# EasyEDA schematic SCH_CubeNixie_2024-07-25.json
TITLE: Cube Nixie; REV: 1.2; Date: 2023-08-09; Sheet: 1/1; Drawn By: cubus; Company: Cubus
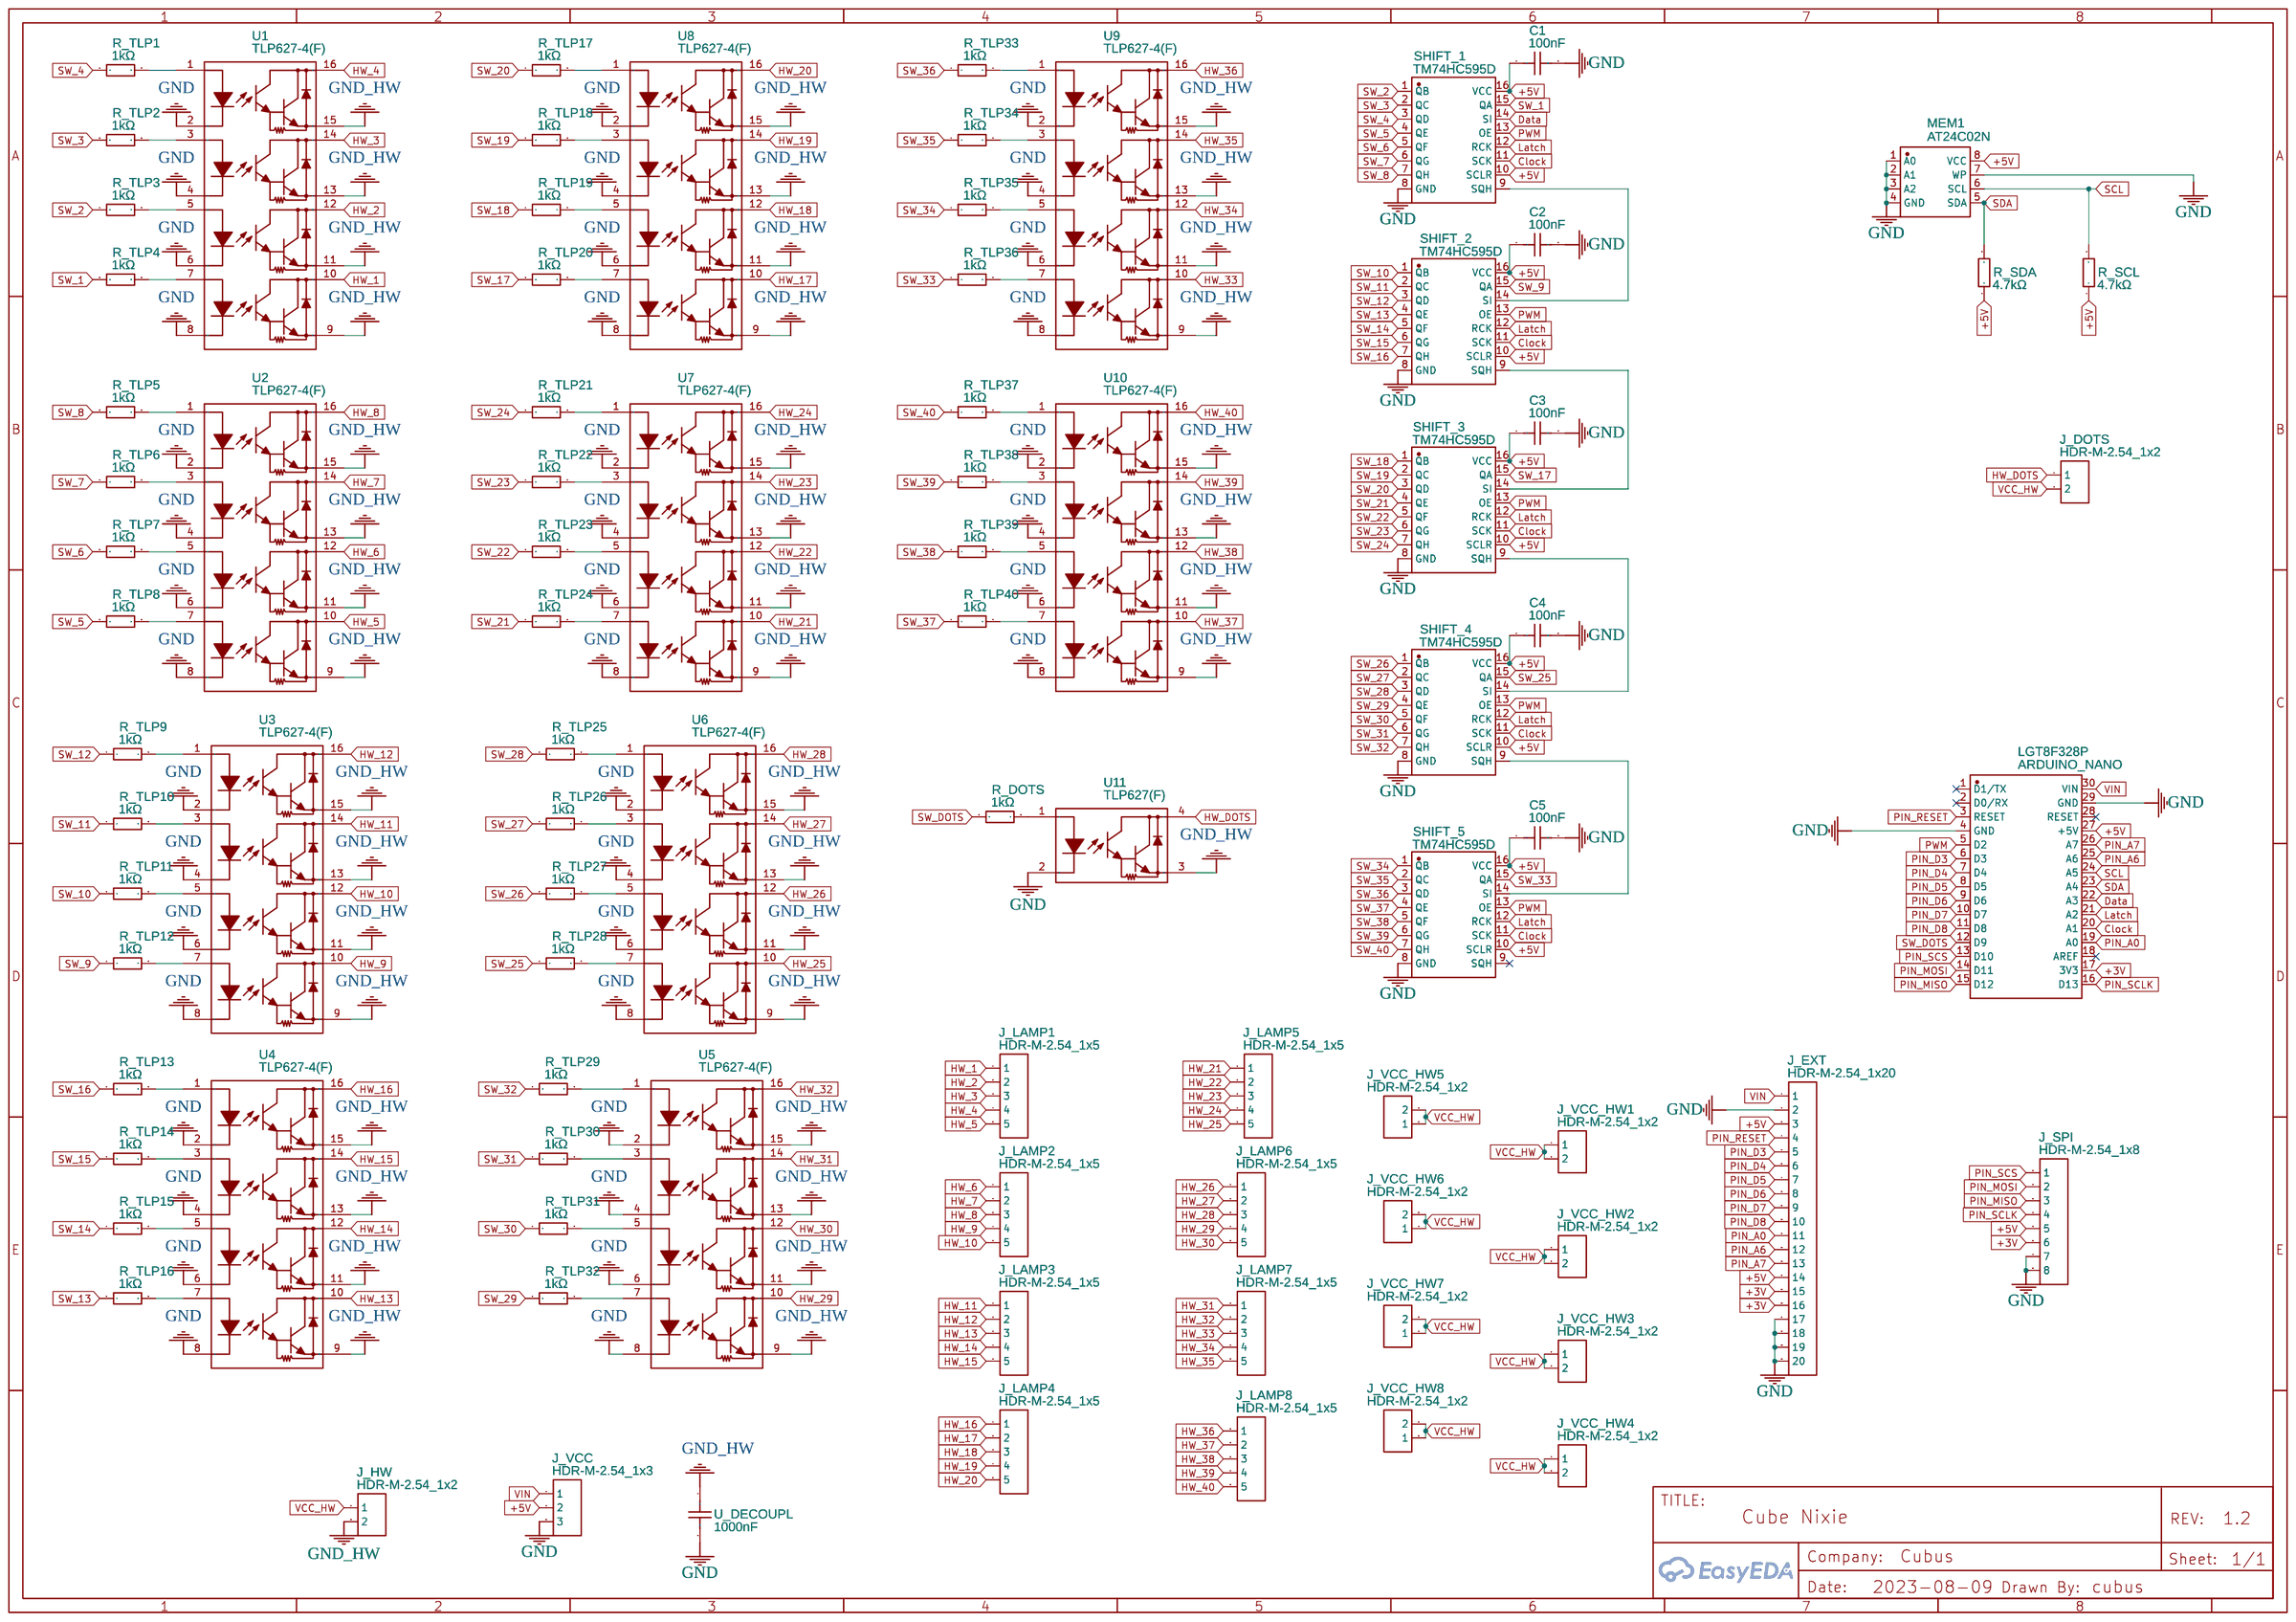
[diagram p0: schematic sheet]

## Parts
C1  100nF  [C1206]
C2  100nF  [C1206]
C3  100nF  [C1206]
C4  100nF  [C1206]
C5  100nF  [C1206]
J_DOTS  HDR-M-2.54_1x2  [HDR-M-2.54_1X2]
J_EXT  HDR-M-2.54_1x20  [HDR-M-2.54_1X20]
J_HW  HDR-M-2.54_1x2  [HDR-M-2.54_1X2]
J_LAMP1  HDR-M-2.54_1x5  [HDR-M-2.54_1X5]
J_LAMP2  HDR-M-2.54_1x5  [HDR-M-2.54_1X5]
J_LAMP3  HDR-M-2.54_1x5  [HDR-M-2.54_1X5]
J_LAMP4  HDR-M-2.54_1x5  [HDR-M-2.54_1X5]
J_LAMP5  HDR-M-2.54_1x5  [HDR-M-2.54_1X5]
J_LAMP6  HDR-M-2.54_1x5  [HDR-M-2.54_1X5]
J_LAMP7  HDR-M-2.54_1x5  [HDR-M-2.54_1X5]
J_LAMP8  HDR-M-2.54_1x5  [HDR-M-2.54_1X5]
J_SPI  HDR-M-2.54_1x8  [HDR-M-2.54_1X8]
J_VCC  HDR-M-2.54_1x3  [HDR-M-2.54_1X3]
J_VCC_HW1  HDR-M-2.54_1x2  [HDR-M-2.54_1X2]
J_VCC_HW2  HDR-M-2.54_1x2  [HDR-M-2.54_1X2]
J_VCC_HW3  HDR-M-2.54_1x2  [HDR-M-2.54_1X2]
J_VCC_HW4  HDR-M-2.54_1x2  [HDR-M-2.54_1X2]
J_VCC_HW5  HDR-M-2.54_1x2  [HDR-M-2.54_1X2]
J_VCC_HW6  HDR-M-2.54_1x2  [HDR-M-2.54_1X2]
J_VCC_HW7  HDR-M-2.54_1x2  [HDR-M-2.54_1X2]
J_VCC_HW8  HDR-M-2.54_1x2  [HDR-M-2.54_1X2]
LGT8F328P  ARDUINO_NANO  [COMM-TH_ARDUINO_NANO]
MEM1  AT24C02N  [DIP-8_L9.2-W6.3-P2.54-LS7.62-BL]
R_DOTS  1kΩ  [R0805]
R_SCL  4.7kΩ  [R0402]
R_SDA  4.7kΩ  [R0402]
R_TLP1  1kΩ  [R0805]
R_TLP2  1kΩ  [R0805]
R_TLP3  1kΩ  [R0805]
R_TLP4  1kΩ  [R0805]
R_TLP5  1kΩ  [R0805]
R_TLP6  1kΩ  [R0805]
R_TLP7  1kΩ  [R0805]
R_TLP8  1kΩ  [R0805]
R_TLP9  1kΩ  [R0805]
R_TLP10  1kΩ  [R0805]
R_TLP11  1kΩ  [R0805]
R_TLP12  1kΩ  [R0805]
R_TLP13  1kΩ  [R0805]
R_TLP14  1kΩ  [R0805]
R_TLP15  1kΩ  [R0805]
R_TLP16  1kΩ  [R0805]
R_TLP17  1kΩ  [R0805]
R_TLP18  1kΩ  [R0805]
R_TLP19  1kΩ  [R0805]
R_TLP20  1kΩ  [R0805]
R_TLP21  1kΩ  [R0805]
R_TLP22  1kΩ  [R0805]
R_TLP23  1kΩ  [R0805]
R_TLP24  1kΩ  [R0805]
R_TLP25  1kΩ  [R0805]
R_TLP26  1kΩ  [R0805]
R_TLP27  1kΩ  [R0805]
R_TLP28  1kΩ  [R0805]
R_TLP29  1kΩ  [R0805]
R_TLP30  1kΩ  [R0805]
R_TLP31  1kΩ  [R0805]
R_TLP32  1kΩ  [R0805]
R_TLP33  1kΩ  [R0805]
R_TLP34  1kΩ  [R0805]
R_TLP35  1kΩ  [R0805]
R_TLP36  1kΩ  [R0805]
R_TLP37  1kΩ  [R0805]
R_TLP38  1kΩ  [R0805]
R_TLP39  1kΩ  [R0805]
R_TLP40  1kΩ  [R0805]
SHIFT_1  TM74HC595D  [SOP-16_L10.0-W3.9-P1.27-LS6.0-BL]
SHIFT_2  TM74HC595D  [SOP-16_L10.0-W3.9-P1.27-LS6.0-BL]
SHIFT_3  TM74HC595D  [SOP-16_L10.0-W3.9-P1.27-LS6.0-BL]
SHIFT_4  TM74HC595D  [SOP-16_L10.0-W3.9-P1.27-LS6.0-BL]
SHIFT_5  TM74HC595D  [SOP-16_L10.0-W3.9-P1.27-LS6.0-BL]
U1  TLP627-4(F)  [DIP-16_L20.0-W6.4-P2.54-LS7.6-BL]
U2  TLP627-4(F)  [DIP-16_L20.0-W6.4-P2.54-LS7.6-BL]
U3  TLP627-4(F)  [DIP-16_L20.0-W6.4-P2.54-LS7.6-BL]
U4  TLP627-4(F)  [DIP-16_L20.0-W6.4-P2.54-LS7.6-BL]
U5  TLP627-4(F)  [DIP-16_L20.0-W6.4-P2.54-LS7.6-BL]
U6  TLP627-4(F)  [DIP-16_L20.0-W6.4-P2.54-LS7.6-BL]
U7  TLP627-4(F)  [DIP-16_L20.0-W6.4-P2.54-LS7.6-BL]
U8  TLP627-4(F)  [DIP-16_L20.0-W6.4-P2.54-LS7.6-BL]
U9  TLP627-4(F)  [DIP-16_L20.0-W6.4-P2.54-LS7.6-BL]
U10  TLP627-4(F)  [DIP-16_L20.0-W6.4-P2.54-LS7.6-BL]
U11  TLP627(F)  [DIP-4_L6.4-W4.6-P2.54-LS7.6-BL]
U_DECOUPL  1000nF  [CAP-TH_L10.5-W5.0-P7.50-D1.2]

## Library data of the parts
C1-C5 = C3216X7R2A104M160AA: Contributor: lcsc; Supplier: LCSC; Supplier Part: C3883507; Manufacturer: TDK; link: https://lcsc.com/eda_search?q=C3883507&%26type=1&ref=editor
J_DOTS J_HW J_VCC_HW1-J_VCC_HW8 = HDR-M-2.54_1x2: Supplier Part: C124375; Supplier: LCSC; Contributor: LCEDA_Lib
J_EXT = HDR-M-2.54_1x20: Supplier Part: C50981; Supplier: LCSC; Contributor: LCEDA_Lib
J_LAMP1-J_LAMP8 = HDR-M-2.54_1x5: Supplier Part: C358687; Supplier: LCSC; Contributor: LCEDA_Lib
J_SPI = HDR-M-2.54_1x8: Supplier Part: C190820; Supplier: LCSC; Contributor: LCEDA_Lib
J_VCC = HDR-M-2.54_1x3: Supplier Part: C180248; Supplier: LCSC; Contributor: LCEDA_Lib
LGT8F328P = ARDUINO_NANO: Supplier: LCSC; Supplier Part: C9900017879; Manufacturer: null; JLCPCB Part Class: Extended Part; Contributor: lcsc
MEM1 = AT24C02N: Supplier: LCSC; Supplier Part: C434606; Manufacturer: HGSEMI; Contributor: LCSC; JLCPCB Part Class: Extended Part
R_DOTS R_TLP1-R_TLP40 = ERJ-6ENF1001V: Contributor: LCSC; Supplier: LCSC; Supplier Part: C79496; Manufacturer: PANASONIC(松下); Manufacturer Part: ERJ6ENF1001V; JLCPCB Part Class: Extended Part; link: https://lcsc.com/eda_search?q=C79496&%26type=1&ref=editor
R_SCL R_SDA = RMC04024.7K5%N: Contributor: LCSC; Supplier: LCSC; Supplier Part: C269679; Manufacturer: Tyohm(幸亚电阻); Manufacturer Part: RMC04024K7JN; JLCPCB Part Class: Extended Part; link: https://lcsc.com/eda_search?q=C269679&%26type=1&ref=editor
SHIFT_1-SHIFT_5 = TM74HC595D: Supplier: LCSC; Manufacturer: TM(天微); Manufacturer Part: TM74HC595; Supplier Part: C79097; JLCPCB Part Class: Extended Part; link: https://lcsc.com/eda_search?q=C79097&%26type=1&ref=editor
U1-U10 = TLP627-4(F): Contributor: LCSC; Supplier: LCSC; Supplier Part: C2987290; Manufacturer: TOSHIBA(东芝); JLCPCB Part Class: Extended Part; link: https://lcsc.com/eda_search?q=C2987290&%26type=1&ref=editor
U11 = TLP627(F): Contributor: LCSC; Supplier: LCSC; Supplier Part: C96253; Manufacturer: TOSHIBA(东芝); JLCPCB Part Class: Extended Part; link: https://lcsc.com/eda_search?q=C96253&%26type=1&ref=editor
U_DECOUPL = CL21-0.1uF400V 5%: Contributor: LCSC; Supplier: LCSC; Supplier Part: C281835; Manufacturer: Tongfeng(铜峰电子); JLCPCB Part Class: Extended Part; link: https://lcsc.com/eda_search?q=C281835&%26type=1&ref=editor

## Nets
+3V: J_EXT.15 J_EXT.16 J_SPI.6 LGT8F328P.17(3V3)
+5V: C1.1 C2.1 C3.1 C4.1 C5.1 J_EXT.3 J_EXT.14 J_SPI.5 J_VCC.2 LGT8F328P.27(+5V) MEM1.8(VCC) R_SCL.1 R_SDA.1 SHIFT_1.10(SCLR) SHIFT_1.16(VCC) SHIFT_2.10(SCLR) SHIFT_2.16(VCC) SHIFT_3.10(SCLR) SHIFT_3.16(VCC) SHIFT_4.10(SCLR) SHIFT_4.16(VCC) SHIFT_5.10(SCLR) SHIFT_5.16(VCC)
GND: C1.2 C2.2 C3.2 C4.2 C5.2 J_EXT.2 J_EXT.17 J_EXT.18 J_EXT.19 J_EXT.20 J_SPI.7 J_SPI.8 J_VCC.3 LGT8F328P.4(GND) LGT8F328P.29(GND) MEM1.1(A0) MEM1.2(A1) MEM1.3(A2) MEM1.4(GND) MEM1.7(WP) SHIFT_1.8(GND) SHIFT_2.8(GND) SHIFT_3.8(GND) SHIFT_4.8(GND) SHIFT_5.8(GND) U1.2 U1.4 U1.6 U1.8 U2.2 U2.4 U2.6 U2.8 U3.2 U3.4 U3.6 U3.8 U4.2 U4.4 U4.6 U4.8 U5.2 U5.4 U5.6 U5.8 U6.2 U6.4 U6.6 U6.8 U7.2 U7.4 U7.6 U7.8 U8.2 U8.4 U8.6 U8.8 U9.2 U9.4 U9.6 U9.8 U10.2 U10.4 U10.6 U10.8 U11.2 U_DECOUPL.2
GND_HW: J_HW.2 U1.9 U1.11 U1.13 U1.15 U2.9 U2.11 U2.13 U2.15 U3.9 U3.11 U3.13 U3.15 U4.9 U4.11 U4.13 U4.15 U5.9 U5.11 U5.13 U5.15 U6.9 U6.11 U6.13 U6.15 U7.9 U7.11 U7.13 U7.15 U8.9 U8.11 U8.13 U8.15 U9.9 U9.11 U9.13 U9.15 U10.9 U10.11 U10.13 U10.15 U11.3 U_DECOUPL.1
VCC_HW: J_DOTS.2 J_HW.1 J_VCC_HW1.1 J_VCC_HW1.2 J_VCC_HW2.1 J_VCC_HW2.2 J_VCC_HW3.1 J_VCC_HW3.2 J_VCC_HW4.1 J_VCC_HW4.2 J_VCC_HW5.1 J_VCC_HW5.2 J_VCC_HW6.1 J_VCC_HW6.2 J_VCC_HW7.1 J_VCC_HW7.2 J_VCC_HW8.1 J_VCC_HW8.2
VIN: J_EXT.1 J_VCC.1 LGT8F328P.30(VIN)
Clock: LGT8F328P.20(A1) SHIFT_1.11(SCK) SHIFT_2.11(SCK) SHIFT_3.11(SCK) SHIFT_4.11(SCK) SHIFT_5.11(SCK)
Data: LGT8F328P.22(A3) SHIFT_1.14(SI)
HW_1: J_LAMP1.1 U1.10
HW_2: J_LAMP1.2 U1.12
HW_3: J_LAMP1.3 U1.14
HW_4: J_LAMP1.4 U1.16
HW_5: J_LAMP1.5 U2.10
HW_6: J_LAMP2.1 U2.12
HW_7: J_LAMP2.2 U2.14
HW_8: J_LAMP2.3 U2.16
HW_9: J_LAMP2.4 U3.10
HW_10: J_LAMP2.5 U3.12
HW_11: J_LAMP3.1 U3.14
HW_12: J_LAMP3.2 U3.16
HW_13: J_LAMP3.3 U4.10
HW_14: J_LAMP3.4 U4.12
HW_15: J_LAMP3.5 U4.14
HW_16: J_LAMP4.1 U4.16
HW_17: J_LAMP4.2 U8.10
HW_18: J_LAMP4.3 U8.12
HW_19: J_LAMP4.4 U8.14
HW_20: J_LAMP4.5 U8.16
HW_21: J_LAMP5.1 U7.10
HW_22: J_LAMP5.2 U7.12
HW_23: J_LAMP5.3 U7.14
HW_24: J_LAMP5.4 U7.16
HW_25: J_LAMP5.5 U6.10
HW_26: J_LAMP6.1 U6.12
HW_27: J_LAMP6.2 U6.14
HW_28: J_LAMP6.3 U6.16
HW_29: J_LAMP6.4 U5.10
HW_30: J_LAMP6.5 U5.12
HW_31: J_LAMP7.1 U5.14
HW_32: J_LAMP7.2 U5.16
HW_33: J_LAMP7.3 U9.10
HW_34: J_LAMP7.4 U9.12
HW_35: J_LAMP7.5 U9.14
HW_36: J_LAMP8.1 U9.16
HW_37: J_LAMP8.2 U10.10
HW_38: J_LAMP8.3 U10.12
HW_39: J_LAMP8.4 U10.14
HW_40: J_LAMP8.5 U10.16
HW_DOTS: J_DOTS.1 U11.4
Latch: LGT8F328P.21(A2) SHIFT_1.12(RCK) SHIFT_2.12(RCK) SHIFT_3.12(RCK) SHIFT_4.12(RCK) SHIFT_5.12(RCK)
PIN_A0: J_EXT.11 LGT8F328P.19(A0)
PIN_A6: J_EXT.12 LGT8F328P.25(A6)
PIN_A7: J_EXT.13 LGT8F328P.26(A7)
PIN_D3: J_EXT.5 LGT8F328P.6(D3)
PIN_D4: J_EXT.6 LGT8F328P.7(D4)
PIN_D5: J_EXT.7 LGT8F328P.8(D5)
PIN_D6: J_EXT.8 LGT8F328P.9(D6)
PIN_D7: J_EXT.9 LGT8F328P.10(D7)
PIN_D8: J_EXT.10 LGT8F328P.11(D8)
PIN_MISO: J_SPI.3 LGT8F328P.15(D12)
PIN_MOSI: J_SPI.2 LGT8F328P.14(D11)
PIN_RESET: J_EXT.4 LGT8F328P.3(RESET)
PIN_SCLK: J_SPI.4 LGT8F328P.16(D13)
PIN_SCS: J_SPI.1 LGT8F328P.13(D10)
PWM: LGT8F328P.5(D2) SHIFT_1.13(OE) SHIFT_2.13(OE) SHIFT_3.13(OE) SHIFT_4.13(OE) SHIFT_5.13(OE)
SCL: LGT8F328P.24(A5) MEM1.6(SCL) R_SCL.2
SDA: LGT8F328P.23(A4) MEM1.5(SDA) R_SDA.2
SW_1: R_TLP4.1 SHIFT_1.15(QA)
SW_2: R_TLP3.1 SHIFT_1.1(QB)
SW_3: R_TLP2.1 SHIFT_1.2(QC)
SW_4: R_TLP1.1 SHIFT_1.3(QD)
SW_5: R_TLP8.1 SHIFT_1.4(QE)
SW_6: R_TLP7.1 SHIFT_1.5(QF)
SW_7: R_TLP6.1 SHIFT_1.6(QG)
SW_8: R_TLP5.1 SHIFT_1.7(QH)
SW_9: R_TLP12.1 SHIFT_2.15(QA)
SW_10: R_TLP11.1 SHIFT_2.1(QB)
SW_11: R_TLP10.1 SHIFT_2.2(QC)
SW_12: R_TLP9.1 SHIFT_2.3(QD)
SW_13: R_TLP16.1 SHIFT_2.4(QE)
SW_14: R_TLP15.1 SHIFT_2.5(QF)
SW_15: R_TLP14.1 SHIFT_2.6(QG)
SW_16: R_TLP13.1 SHIFT_2.7(QH)
SW_17: R_TLP20.1 SHIFT_3.15(QA)
SW_18: R_TLP19.1 SHIFT_3.1(QB)
SW_19: R_TLP18.1 SHIFT_3.2(QC)
SW_20: R_TLP17.1 SHIFT_3.3(QD)
SW_21: R_TLP24.1 SHIFT_3.4(QE)
SW_22: R_TLP23.1 SHIFT_3.5(QF)
SW_23: R_TLP22.1 SHIFT_3.6(QG)
SW_24: R_TLP21.1 SHIFT_3.7(QH)
SW_25: R_TLP28.1 SHIFT_4.15(QA)
SW_26: R_TLP27.1 SHIFT_4.1(QB)
SW_27: R_TLP26.1 SHIFT_4.2(QC)
SW_28: R_TLP25.1 SHIFT_4.3(QD)
SW_29: R_TLP32.1 SHIFT_4.4(QE)
SW_30: R_TLP31.1 SHIFT_4.5(QF)
SW_31: R_TLP30.1 SHIFT_4.6(QG)
SW_32: R_TLP29.1 SHIFT_4.7(QH)
SW_33: R_TLP36.1 SHIFT_5.15(QA)
SW_34: R_TLP35.1 SHIFT_5.1(QB)
SW_35: R_TLP34.1 SHIFT_5.2(QC)
SW_36: R_TLP33.1 SHIFT_5.3(QD)
SW_37: R_TLP40.1 SHIFT_5.4(QE)
SW_38: R_TLP39.1 SHIFT_5.5(QF)
SW_39: R_TLP38.1 SHIFT_5.6(QG)
SW_40: R_TLP37.1 SHIFT_5.7(QH)
SW_DOTS: LGT8F328P.12(D9) R_DOTS.1
Net-(R_DOTS-2): R_DOTS.2 U11.1
Net-(R_TLP1-2): R_TLP1.2 U1.1
Net-(R_TLP2-2): R_TLP2.2 U1.3
Net-(R_TLP3-2): R_TLP3.2 U1.5
Net-(R_TLP4-2): R_TLP4.2 U1.7
Net-(R_TLP5-2): R_TLP5.2 U2.1
Net-(R_TLP6-2): R_TLP6.2 U2.3
Net-(R_TLP7-2): R_TLP7.2 U2.5
Net-(R_TLP8-2): R_TLP8.2 U2.7
Net-(R_TLP9-2): R_TLP9.2 U3.1
Net-(R_TLP10-2): R_TLP10.2 U3.3
Net-(R_TLP11-2): R_TLP11.2 U3.5
Net-(R_TLP12-2): R_TLP12.2 U3.7
Net-(R_TLP13-2): R_TLP13.2 U4.1
Net-(R_TLP14-2): R_TLP14.2 U4.3
Net-(R_TLP15-2): R_TLP15.2 U4.5
Net-(R_TLP16-2): R_TLP16.2 U4.7
Net-(R_TLP17-2): R_TLP17.2 U8.1
Net-(R_TLP18-2): R_TLP18.2 U8.3
Net-(R_TLP19-2): R_TLP19.2 U8.5
Net-(R_TLP20-2): R_TLP20.2 U8.7
Net-(R_TLP21-2): R_TLP21.2 U7.1
Net-(R_TLP22-2): R_TLP22.2 U7.3
Net-(R_TLP23-2): R_TLP23.2 U7.5
Net-(R_TLP24-2): R_TLP24.2 U7.7
Net-(R_TLP25-2): R_TLP25.2 U6.1
Net-(R_TLP26-2): R_TLP26.2 U6.3
Net-(R_TLP27-2): R_TLP27.2 U6.5
Net-(R_TLP28-2): R_TLP28.2 U6.7
Net-(R_TLP29-2): R_TLP29.2 U5.1
Net-(R_TLP30-2): R_TLP30.2 U5.3
Net-(R_TLP31-2): R_TLP31.2 U5.5
Net-(R_TLP32-2): R_TLP32.2 U5.7
Net-(R_TLP33-2): R_TLP33.2 U9.1
Net-(R_TLP34-2): R_TLP34.2 U9.3
Net-(R_TLP35-2): R_TLP35.2 U9.5
Net-(R_TLP36-2): R_TLP36.2 U9.7
Net-(R_TLP37-2): R_TLP37.2 U10.1
Net-(R_TLP38-2): R_TLP38.2 U10.3
Net-(R_TLP39-2): R_TLP39.2 U10.5
Net-(R_TLP40-2): R_TLP40.2 U10.7
Net-(SHIFT_1-9): SHIFT_1.9(SQH) SHIFT_2.14(SI)
Net-(SHIFT_2-9): SHIFT_2.9(SQH) SHIFT_3.14(SI)
Net-(SHIFT_3-9): SHIFT_3.9(SQH) SHIFT_4.14(SI)
Net-(SHIFT_4-9): SHIFT_4.9(SQH) SHIFT_5.14(SI)

Not connected (* = marked no-connect by the designer): LGT8F328P 1(D1/TX)* 2(D0/RX)* 18(AREF)* 28(RESET)*; SHIFT_5 9(SQH)*
